# Altium schematic sheet Receivers.SchDoc
size A4; SheetNumber: 4; SheetTotal: 7
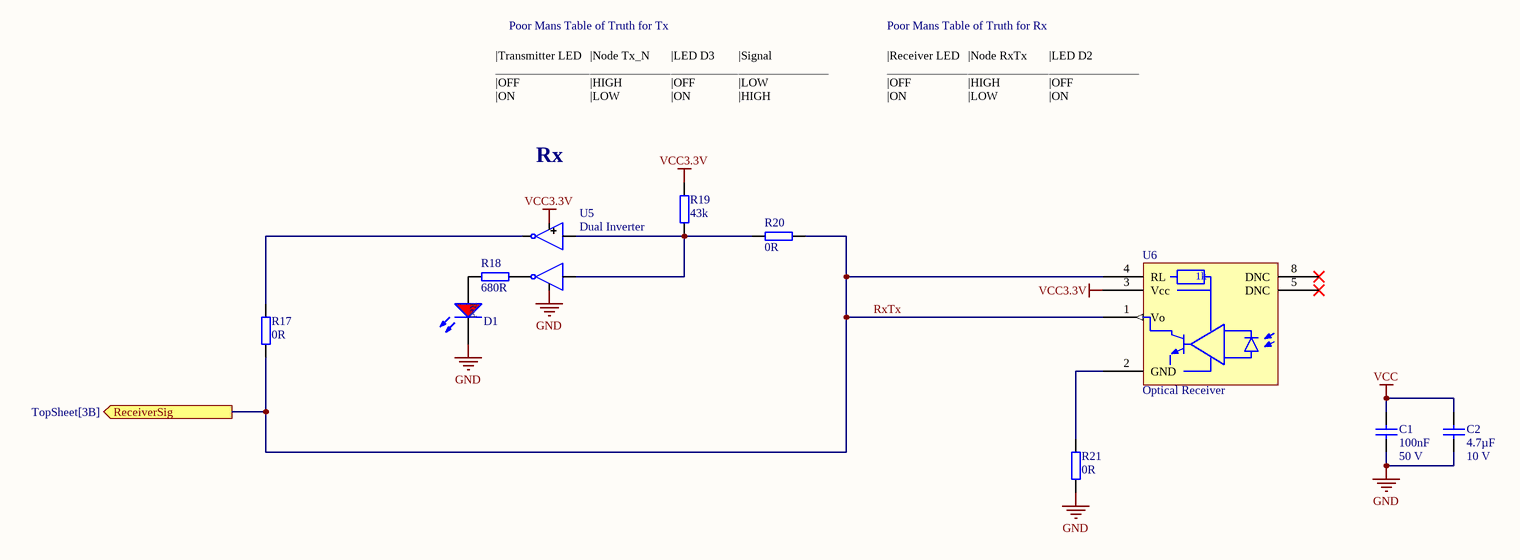
[diagram p0: Receivers.SchDoc]

## Parts
C1  Rated Voltage: 50 V  [C_0603(1608)100_L]  (hidden comment: 100nF)
C2  Voltage: 10 V  [CAP_2012X06N]  (hidden comment: 4.7µF)
D1  150060RS75000  [WL-SMCW_0603]  (value not drawn)
R17  0R  [R_0603_N]
R18  680R  [R_0603_N]
R19  43k  [R_0603_N]
R20  0R  [R_0603_N]
R21  0R  [R_0603_N]
U5  Dual Inverter  [SN74LVC2GU04DCKR]
U6  Optical Receiver  [HFBRx5XX]

## Ports
ReceiverSig (out, see TopSheet[3B])

## Nets
GND: C1.2 C2.2 D1.1(K) R21.2 U5.2(GND)
VCC: C1.1 C2.1
VCC3.3V: R19.1 U5.5(VCC) U6.3(Vcc)
RxTx: R17.1 R20.2 U6.1(Vo) U6.4(RL) ; port ReceiverSig
NetD1_2: D1.2(A) R18.2
NetR17_2: R17.2 U5.6(OUT2)
NetR18_1: R18.1 U5.4(OUT2)
NetR19_2: R19.2 R20.1 U5.1(IN1) U5.3(IN2)
NetR21_1: R21.1 U6.2(GND)

Not connected (* = marked no-connect by the designer): U6 5(DNC)* 8(DNC)*

## Notes on the sheet
- Poor Mans Table of Truth for Tx
- Poor Mans Table of Truth for Rx
- |Transmitter LED
  _________________
  |OFF
  |ON
- |Node Tx_N
  _________________
  |HIGH
  |LOW
- |LED D3
  _______________
  |OFF
  |ON
- GATE
  _______
  LOW
  HIGH
- |Signal
  _______________
  |LOW
  |HIGH
- |Receiver LED
  ________________
  |OFF
  |ON
- |Node RxTx
  _________________
  |HIGH
  |LOW
- |LED D2
  _______________
  |OFF
  |ON
- Rx
- (in symbol HFBR-2528Z) 1k

## Library data of the parts
C1 = C_0603: CAP 0603 (1608 Metric) SMD; Tolerance: ±5%; Case-Metric: 1608; Case-EIA: 0603; Max Thickness: 1 mm; Technology: SMT; Created: 2018_09_06_AGeiger; Dielectric: *; Supplier 1: *; Supplier Part Number 1: *; MF: *; MPN: *; Value: 100nF; Package: 0603; LCSC Part #: C14663
C2 = C_0805: CAP 0805 (2012 Metric) SMD; MPN: LMF212B7475KGHT; Tolerance: ±10%; Case-Metric: 2012; Dielectric: X7R; MF: Taiyo Yuden; Case-EIA: 0805; Max Thickness: 1 mm; Technology: SMT; Created: 2018_09_06_AGeiger; Supplier 1: Mouser; Supplier Part Number 1: 963-LMF212B7475KGHT; Value: 4.7µF; Package: 0805; LCSC Part #: C1779
D1 = LED_Red_0603: WL-SMCW SMD Mono-color Chip LED Waterclear, size 0603, Red, 2 V, 140°; Forward Voltage: 2 V; Luminous Intensity: 250 mcd; Peak Wavelength: 630 nm; Dominant Wavelength: 625 nm; MF: Wuerth Elektronik; Published Date: Sep. 2017; ComponentLink1Description: Manufacturer; ComponentLink1URL: http://www.we-online.de; ComponentLink2Description: Datasheet; ComponentLink2URL: http://katalog.we-online.com/led/datasheet/150060RS75000.pdf; MPN: 150060RS75000; Size: 0603; Viewing Angle: 140°; Emitting Color: Red; Value: 150060RS75000; Package: 0603; Created: 2018_09_06_AGeiger; Supplier 1: Farnell; Supplier Part Number 1: 2322071; Supplier 2: Mouser; Supplier Part Number 2: 710-150060RS75000; Supplier 3: Digi-Key; Supplier Part Number 3: 732-4978-1-ND; LCSC Part #: C2286
R17 R20 = R_0603_JLC: SMD Resistor 0603; Tolerance: 1%; Voltage: 75V; Power: 100 mW; Package: 0603; Value: 0R; Created: 2018_09_06_AGeiger; Supplier 1: Mouser; Supplier Part Number 1: 71-CRCW06030000Z0EBC; LCSC Part #: C21189
R18 = R_0603: SMD Resistor 0603; MPN: CR0603-FX-3901ELF; Tolerance: 1%; Voltage: 75V; Power: 100 mW; MF: Bourns; Package: 0603; Value: 680R; Created: 2018_09_06_AGeiger; Supplier 1: Mouser; Supplier Part Number 1: 652-CR0603-FX3901ELF; LCSC Part #: C23228
R19 = R_0603_JLC: SMD Resistor 0603; Tolerance: 1%; Voltage: 50V; Power: 100 mW; Package: 0603; Value: 43k; Created: 2018_09_06_AGeiger; Supplier 1: *; Supplier Part Number 1: *; LCSC Part #: C23172
R21 = R_0603: SMD Resistor 0603; MPN: CRCW06030000Z0EBC; Tolerance: 1%; Voltage: 75V; Power: 100 mW; MF: Vishay; Package: 0603; Value: 0R; Created: 2018_09_06_AGeiger; Supplier 1: Mouser; Supplier Part Number 1: 71-CRCW06030000Z0EBC; LCSC Part #: C21189
U5 = SN74LVC2GU04DCKR: This dual inverter is designed for 1.65-V to 5.5-V VCC / operation.; LCSC Part #: C116660; JLCSMT Rotation: 180
U6 = HFBR-2528Z: Fibre Optic Receivers, LINK HORIZ 5MBd RC VR RoHS; MPN: HFBR-2521Z; Suppier Part Number 2: 516-2062-ND; MF: Boadcom/Avago; Wavelength: 660 nm; Iout max: 25 mA; Supply Voltage: 5V; Created: 2019_04_09_Kreppel; Data Rate: 5 MBd; Supplier 1: Mouser; Supplier 2: Digi-Key; Supplier Part Number 1: 630-HFBR-2521Z